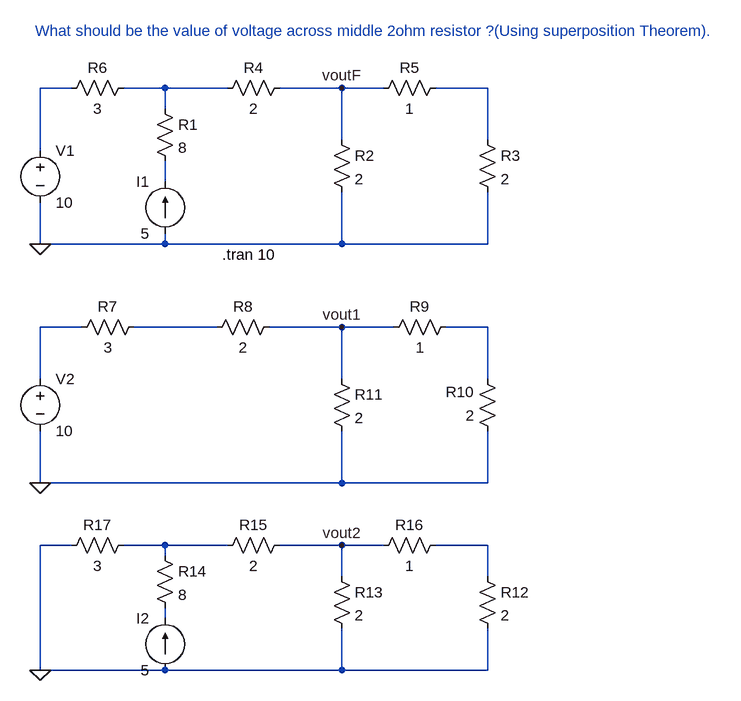
[diagram p0: schematic Lab1_ques5.asc]
Lab1_ques5.asc, the LTspice schematic file:
Version 4
SHEET 1 880 1008
WIRE -304 96 -352 96
WIRE -160 96 -224 96
WIRE -64 96 -160 96
WIRE 112 96 16 96
WIRE 176 96 112 96
WIRE 336 96 256 96
WIRE -160 128 -160 96
WIRE 112 176 112 96
WIRE 336 176 336 96
WIRE -352 192 -352 96
WIRE -160 240 -160 208
WIRE -352 336 -352 272
WIRE -160 336 -160 320
WIRE -160 336 -352 336
WIRE 112 336 112 256
WIRE 112 336 -160 336
WIRE 336 336 336 256
WIRE 336 336 112 336
WIRE -288 464 -352 464
WIRE -80 464 -208 464
WIRE 112 464 0 464
WIRE 192 464 112 464
WIRE 336 464 272 464
WIRE -352 544 -352 464
WIRE 112 544 112 464
WIRE 336 544 336 464
WIRE -352 704 -352 624
WIRE 112 704 112 624
WIRE 112 704 -352 704
WIRE 336 704 336 624
WIRE 336 704 112 704
WIRE -304 800 -352 800
WIRE -160 800 -224 800
WIRE -64 800 -160 800
WIRE 112 800 16 800
WIRE 176 800 112 800
WIRE 336 800 256 800
WIRE -160 816 -160 800
WIRE 112 848 112 800
WIRE 336 848 336 800
WIRE -160 912 -160 896
WIRE -352 992 -352 800
WIRE -160 992 -352 992
WIRE 112 992 112 928
WIRE 112 992 -160 992
WIRE 336 992 336 928
WIRE 336 992 112 992
FLAG 112 800 vout2
FLAG 112 464 vout1
FLAG 112 96 voutF
FLAG -352 992 0
FLAG -352 704 0
FLAG -352 336 0
SYMBOL Res -176 112 R0
SYMATTR InstName R1
SYMATTR Value 8
SYMBOL Res 96 160 R0
SYMATTR InstName R2
SYMATTR Value 2
SYMBOL Res 320 160 R0
SYMATTR InstName R3
SYMATTR Value 2
SYMBOL Res 32 80 R90
WINDOW 0 0 56 VBottom 2
WINDOW 3 32 56 VTop 2
SYMATTR InstName R4
SYMATTR Value 2
SYMBOL Res 272 80 R90
WINDOW 0 0 56 VBottom 2
WINDOW 3 32 56 VTop 2
SYMATTR InstName R5
SYMATTR Value 1
SYMBOL Res -208 80 R90
WINDOW 0 0 56 VBottom 2
WINDOW 3 32 56 VTop 2
SYMATTR InstName R6
SYMATTR Value 3
SYMBOL Voltage -352 176 R0
SYMATTR InstName V1
SYMATTR Value 10
SYMBOL current -160 320 R180
WINDOW 0 24 80 Left 2
WINDOW 3 24 0 Left 2
SYMATTR InstName I1
SYMATTR Value 5
SYMBOL Voltage -352 528 R0
SYMATTR InstName V2
SYMATTR Value 10
SYMBOL Res -192 448 R90
WINDOW 0 0 56 VBottom 2
WINDOW 3 32 56 VTop 2
SYMATTR InstName R7
SYMATTR Value 3
SYMBOL Res 16 448 R90
WINDOW 0 0 56 VBottom 2
WINDOW 3 32 56 VTop 2
SYMATTR InstName R8
SYMATTR Value 2
SYMBOL Res 288 448 R90
WINDOW 0 0 56 VBottom 2
WINDOW 3 32 56 VTop 2
SYMATTR InstName R9
SYMATTR Value 1
SYMBOL Res 352 640 R180
WINDOW 0 36 76 Left 2
WINDOW 3 36 40 Left 2
SYMATTR InstName R10
SYMATTR Value 2
SYMBOL Res 96 528 R0
SYMATTR InstName R11
SYMATTR Value 2
SYMBOL Res 320 832 R0
SYMATTR InstName R12
SYMATTR Value 2
SYMBOL Res 96 832 R0
SYMATTR InstName R13
SYMATTR Value 2
SYMBOL Res -176 800 R0
SYMATTR InstName R14
SYMATTR Value 8
SYMBOL Res 32 784 R90
WINDOW 0 0 56 VBottom 2
WINDOW 3 32 56 VTop 2
SYMATTR InstName R15
SYMATTR Value 2
SYMBOL Res 272 784 R90
WINDOW 0 0 56 VBottom 2
WINDOW 3 32 56 VTop 2
SYMATTR InstName R16
SYMATTR Value 1
SYMBOL Res -208 784 R90
WINDOW 0 0 56 VBottom 2
WINDOW 3 32 56 VTop 2
SYMATTR InstName R17
SYMATTR Value 3
SYMBOL current -160 992 R180
WINDOW 0 24 80 Left 2
WINDOW 3 24 0 Left 2
SYMATTR InstName I2
SYMATTR Value 5
TEXT -360 8 Left 2 ;What should be the value of voltage across middle 2ohm resistor ?(Using superposition Theorem).
TEXT -72 352 Left 2 !.tran 10

The netlist it stands for:
* Lab1_ques5.asc
R1 N002 N004 8
R2 voutF 0 2
R3 N003 0 2
R4 voutF N002 2
R5 N003 voutF 1
R6 N002 N001 3
V1 N001 0 10
I1 0 N004 5
V2 N005 0 10
R7 N006 N005 3
R8 vout1 N006 2
R9 N007 vout1 1
R10 0 N007 2
R11 vout1 0 2
R12 N009 0 2
R13 vout2 0 2
R14 N008 N010 8
R15 vout2 N008 2
R16 N009 vout2 1
R17 N008 0 3
I2 0 N010 5
* What should be the value of voltage across middle 2ohm resistor ?(Using superposition Theorem).
.tran 10
.backanno
.end